# Altium schematic sheet S4V_ToF_Sensor_Module_Board_V1.0_Schematic.SchDoc
size A3; SheetNumber: 1; SheetTotal: 1
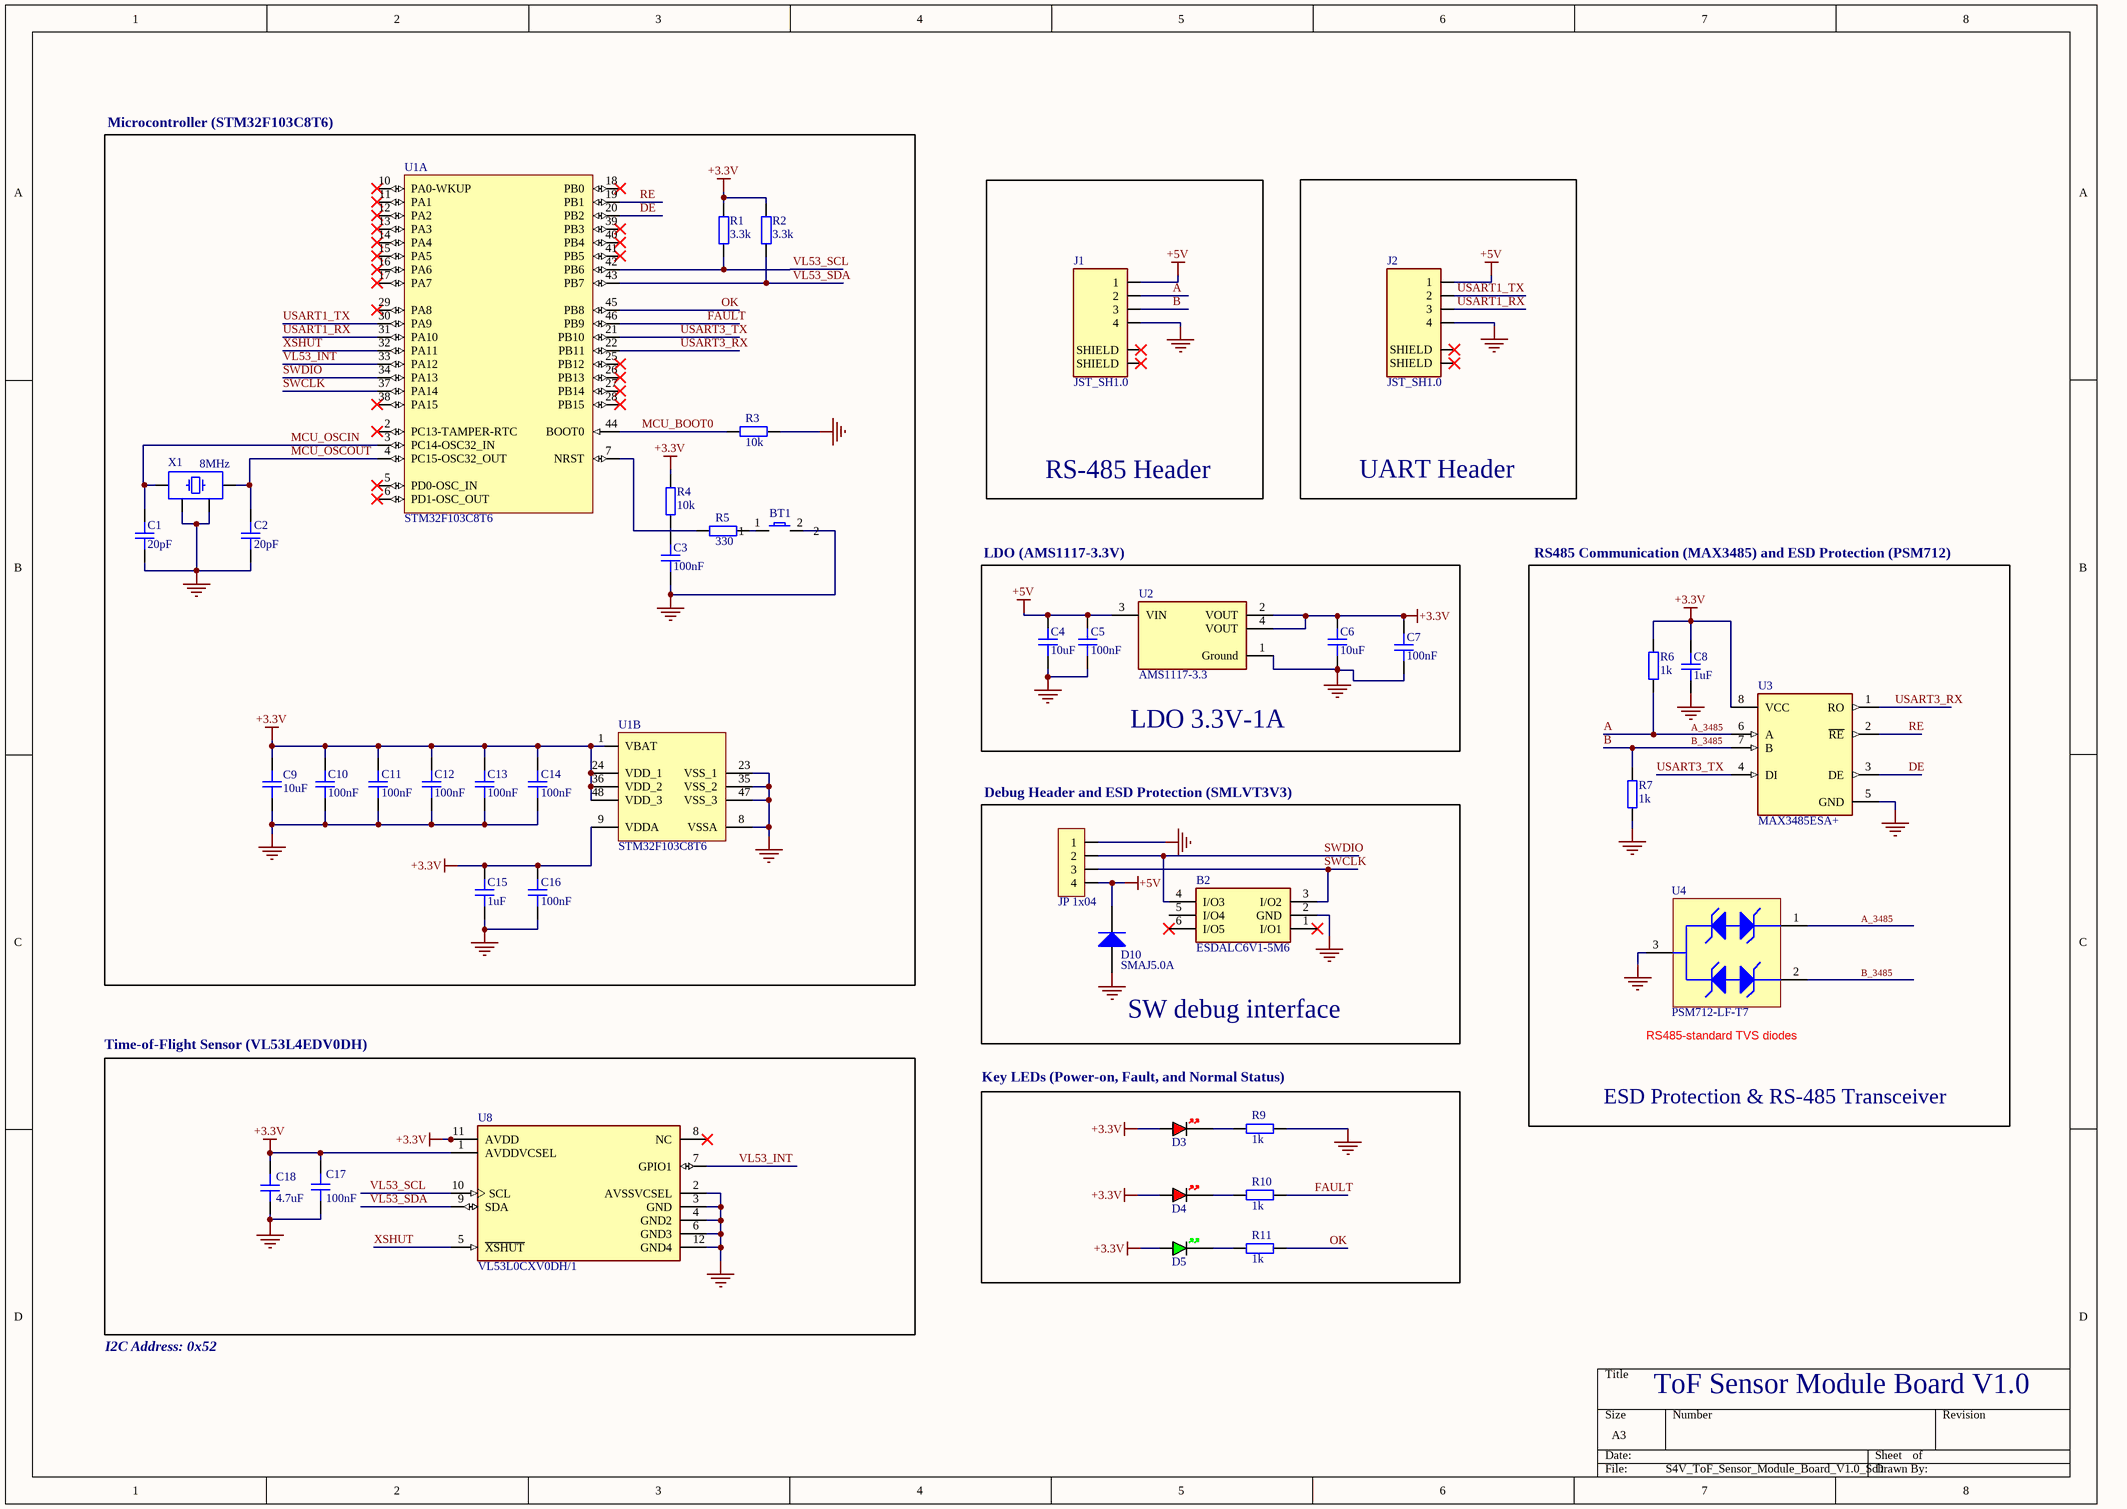
[diagram p0: S4V_ToF_Sensor_Module_Board_V1.0_Schematic.SchDoc]

## Parts
B2  ESDALC6V1-5M6  [ESDALC6V15M6]
BT1  Button_3x4mm_SMD  [Button_3x4mm_SMD]  (value not drawn)
C1  20pF  [CAP_0603]
C2  20pF  [CAP_0603]
C3  100nF  [CAP_0603]
C4  10uF  [CAP_0603]
C5  100nF  [CAP_0603]
C6  10uF  [CAP_0603]
C7  100nF  [CAP_0603]
C8  1uF  [CAP_0603]
C9  10uF  [CAP_0603]
C10  100nF  [CAP_0603]
C11  100nF  [CAP_0603]
C12  100nF  [CAP_0603]
C13  100nF  [CAP_0603]
C14  100nF  [CAP_0603]
C15  1uF  [CAP_0603]
C16  100nF  [CAP_0603]
C17  100nF  [CAP_0603]
C18  4.7uF  [CAP_0603]
D3  RED  [LED_0603_RED]  (value not drawn)
D4  RED  [LED_0603_RED]  (value not drawn)
D5  GREEN  [LED_0603_GREEN]  (value not drawn)
D10  SMAJ5.0A  [BOUR-SMA-2_V]
J1  JST_SH1.0  [JST_SM04B-SRSS-TB(LF)(SN)]
J2  JST_SH1.0  [JST_SM04B-SRSS-TB(LF)(SN)]
JP1  JP 1x04  [JP 1x4 DT]
R1  3.3k  [RES_0603]
R2  3.3k  [RES_0603]
R3  10k  [RES_0603]
R4  10k  [RES_0603]
R5  330  [RES_0603]
R6  1k  [RES_0603]
R7  1k  [RES_0603]
R9  1k  [RES_0603]
R10  1k  [RES_0603]
R11  1k  [RES_0603]
U1  STM32F103C8T6  [STM-LQFP48_L]  (parts A,B of 2)
U2  AMS1117-3.3  [FP-AMS1117-IPC_C]
U3  MAX3485ESA+  [FP-S8-5-MFG]
U4  PSM712-LF-T7  [PRKT-SOT23-3_V]
U8  VL53L0CXV0DH/1  [FP-LGA-12-MFG]
X1  8MHz  [XTAL_3225]

## Blocks framed on the sheet
Microcontroller (STM32F103C8T6): BT1 C1-C3 C9-C16 R1-R5 U1 X1
RS-485 Header: J1
UART Header: J2
LDO 3.3V-1A: C4-C7 U2
ESD Protection & RS-485 Transceiver: C8 R6 R7 U3 U4
SW debug interface: B2 D10 JP1
Time-of-Flight Sensor (VL53L4EDV0DH): C17 C18 U8
Key LEDs (Power-on, Fault, and Normal Status): D3-D5 R9-R11

## Nets
+3.3V: C6.2 C7.2 C8.2 C9.2 C10.2 C11.2 C12.2 C13.2 C14.2 C15.2 C16.2 C17.2 C18.2 D3.A D4.A D5.A R1.2 R2.2 R4.2 R6.1 U1.1(VBAT) U1.9(VDDA) U1.24(VDD_1) U1.36(VDD_2) U1.48(VDD_3) U2.2(VOUT) U2.4(VOUT) U3.8(VCC) U8.1(AVDDVCSEL) U8.11(AVDD)
+5V: C4.2 C5.2 D10.2(K) J1.1 J2.1 JP1.4 U2.3(VIN)
GND: B2.2(GND) BT1.2 C1.1 C2.1 C3.1 C4.1 C5.1 C6.1 C7.1 C8.1 C9.1 C10.1 C11.1 C12.1 C13.1 C14.1 C15.1 C16.1 C17.1 C18.1 D10.1(A) J1.4 J2.4 JP1.1 R3.2 R7.1 R9.2 U1.8(VSSA) U1.23(VSS_1) U1.35(VSS_2) U1.47(VSS_3) U2.1(Ground) U3.5(GND) U4.3 U8.2(AVSSVCSEL) U8.3(GND) U8.4(GND2) U8.6(GND3) U8.12(GND4) X1.2 X1.4
A: J1.2 R6.2 U3.6(A) U4.1  [also labelled A_3485]
B: J1.3 R7.2 U3.7(B) U4.2  [also labelled B_3485]
DE: U1.20(PB2) U3.3(DE)
FAULT: R10.2 U1.46(PB9)
MCU_BOOT0: R3.1 U1.44(BOOT0)
MCU_OSCIN: C1.2 U1.3(PC14-OSC32_IN) X1.1
MCU_OSCOUT: C2.2 U1.4(PC15-OSC32_OUT) X1.3
OK: R11.2 U1.45(PB8)
RE: U1.19(PB1) U3.2(~{RE})
SWCLK: B2.3(I/O2) JP1.3 U1.37(PA14)
SWDIO: B2.4(I/O3) JP1.2 U1.34(PA13)
USART1_RX: J2.3 U1.31(PA10)
USART1_TX: J2.2 U1.30(PA9)
USART3_RX: U1.22(PB11) U3.1(RO)
USART3_TX: U1.21(PB10) U3.4(DI)
VL53_INT: U1.33(PA12) U8.7(GPIO1)
VL53_SCL: R1.1 U1.42(PB6) U8.10(SCL)
VL53_SDA: R2.1 U1.43(PB7) U8.9(SDA)
XSHUT: U1.32(PA11) U8.5(~{XSHUT})
NetBT1_1: BT1.1 R5.2
NetC3_2: C3.2 R4.1
NetD3_K: D3.K R9.1
NetD4_K: D4.K R10.1
NetD5_K: D5.K R11.1
NetR5_1: R5.1 U1.7(NRST)

Not connected (* = marked no-connect by the designer): B2 1(I/O1)* 5(I/O4) 6(I/O5)*; J1 S1(SHIELD)* S2(SHIELD)*; J2 S1(SHIELD)* S2(SHIELD)*; U1 2(PC13-TAMPER-RTC)* 5(PD0-OSC_IN)* 6(PD1-OSC_OUT)* 10(PA0-WKUP)* 11(PA1)* 12(PA2)* 13(PA3)* 14(PA4)* 15(PA5)* 16(PA6)* 17(PA7)* 18(PB0)* 25(PB12)* 26(PB13)* 27(PB14)* 28(PB15)* 29(PA8)* 38(PA15)* 39(PB3)* 40(PB4)* 41(PB5)*; U8 8(NC)*

## Notes on the sheet
- LDO (AMS1117-3.3V)
- RS485 Communication (MAX3485) and ESD Protection (PSM712)
- (near JP1) Debug Header and ESD Protection (SMLVT3V3)
- (near U4) RS485-standard TVS diodes
- I2C Address: 0x52
- ToF Sensor Module Board V1.0

## Library data of the parts
B2 = ESDALC6V1-5M6: STMicroelectronics ESDALC6V1-5M6 Quint Uni-Directional TVS Diode, 30W peak, 6-Pin uQFN; Geometry.Height: 0.65mm; Manufacturer_Name: STMicroelectronics; Manufacturer_Part_Number: ESDALC6V1-5M6; Mouser Part Number: 511-ESDALC6V1-5M6; Mouser Price/Stock: https://www.mouser.co.uk/ProductDetail/STMicroelectronics/ESDALC6V1-5M6?qs=riAxU6JNBCsF7CaldDOuJw%3D%3D; Arrow Part Number: ESDALC6V1-5M6; Arrow Price/Stock: https://www.arrow.com/en/products/esdalc6v1-5m6/stmicroelectronics?utm_currency=USD&region=nac; Datasheet Link: https://www.st.com/resource/en/datasheet/esdalc6v1-5m6.pdf
BT1 = Button_3x4mm_SMD: Button SMD 3x4mm 2 Pins
C1-C18 = CAP_0603: Capacitor SMD 0603; Manufacturer: *; Manufacturer Part Number: *; Distributor Link: *; LCSC: *; Rating: *; Dielectric: *
D3 D4 = LED_0603_RED: LED 0603 RED SMD
D5 = LED_0603_GREEN: LED 0603 GREEN SMD
D10 = CMP-2000-07090-1: SMAJ Transient Voltage Suppressor Diode Series, 3.5 V, -55 to 150 degC, 2-Pin SMA, RoHS, Tape and Reel; Manufacturer: Bourns; EDA / CAD Models: DownloadfromAcceleratedDesigns; Unidirectional Channels: 1; Voltage - Breakdown (Min): 6.4V; Voltage - Reverse Standoff (Typ): 5V; Voltage - Clamping (Max) @ Ipp: 9.2V; Other Names: SMAJ5.0ABDKR; Type: Zener; Catalog Drawings: SMAJSeriesFootprintSMAJ,SMBJSeries; Featured Product: SMAJ/SMBJ/SMCJ/SMLJDiscreteTVSDiodes; Power - Peak Pulse: 400W; Current - Peak Pulse (10/1000µs): 43.5A; Power Line Protection: No; Online Catalog: SMAJSeries; Supplier Device Package: SMA(DO-214AC); Operating Temperature: -55°C~150°C(TJ); Package Description: 2-Pin Surface Mount Device, Body 4.315 x 2.605 mm; Datasheet URL: https://datasheet.ciiva.com/25624/0900766b8112213b-25624680.pdf; Manufacturer URL: http://www.bourns.com/; Datasheet Version: 08/2012; Series: SMAJ; Family: TVS-Diodes; Bidirectional Channels: -; Applications: GeneralPurpose; Package Reference: SMA-2; Standard Package: 1; Package / Case: DO-214AC,SMA; Category: CircuitProtection; RoHS Information: SMAJSeriesMaterialDeclaration; Mounting Technology: SurfaceMount; Capacitance @ Frequency: -; Packaging: Digi-Reel®; Mounting Type: SurfaceMount
J1 J2 = CMP-002-00071-1: Connector Header Surface Mount, Right Angle 4 position 0.039 (1.00mm); MF: JST Sales; Case/Package: None; MP: SM04B-SRSS-TB(LF)(SN); Source: SM04B-SRSS-TB(LF)(SN).SchLib; Value: *; Pins: 6; Component Type: Standard; Check_prices: https://www.snapeda.com/parts/SM04B-SRSS-TB(LF)(SN)/JST/view-part/?ref=eda; SnapEDA_Link: https://www.snapeda.com/parts/SM04B-SRSS-TB(LF)(SN)/JST/view-part/?ref=snap; Design Item ID: SM04B-SRSS-TB(LF)(SN)
JP1 = JP 1x4 2.54 Duc Thang: Cắm; Ten_Linh_Kien: Jump Đơn Đực 2.54MM 1x40P Thẳng 11MM; Don_Vi: Con; Ma_Hang: MH000903; Ghi_Chu: *; Kieu_Chan: *; Chung_Loai: Cắm
R1-R7 R9-R11 = RES_0603: Resistor SMD 0603; Manufacturer: *; Manufacturer Part Number: *; Distributor Link: *; LCSC: *
U1 = CMP-0237-00215-3: ARM Cortex-M3 32-bit MCU, 64 KB Flash, 20 KB Internal RAM, 37 I/Os, 48-pin LQFP, -40 to 85 degC, Tray; Supply Voltage(Vcc) min (V): 2; Internal RAM Size (kB): 20; FLASH Size (Prog) (kB): 64; A/D Converter: 2x12-bit (10 Channel); I/Os (High Current): 37; Operating Frequency(F) (Processor speed) (MHz): 72; Core: ARM Cortex-M3; ComponentLink3Description: Package Specification; Mounting Technology: Surface Mount; PartNumber: STM32F103C8T6; PackageReference: LQFP48; Packing: Tray; ComponentLink3URL: http://www.st.com/st-web-ui/static/active/en/resource/technical/document/datasheet/DM00058181.pdf; DatasheetVersion: Rev. 16; ComponentLink1URL: http://www.st.com/web/en/home.html; PackageVersion: Rev. 6, 06/2013; ComponentLink2URL: http://www.st.com/st-web-ui/static/active/en/resource/technical/document/datasheet/CD00161566.pdf; ComponentLink1Description: Manufacturer URL; ComponentLink2Description: Datasheet; PackageDescription: 48-Pin Low Profile Quad Flat Package, 7 x 7 mm Body, 0.5 mm Pitch
U2 = CMP-209535-000001-1: LDO Voltage Regulators 1A, 3.3V; Manufacturer: Advanced Monolithic Systems; Dropout Voltage: 1.1V; Output Type: Fixed; Nominal Supply Current: 5mA; Max Power Dissipation: 1.2W; Max Supply Voltage: 15V; Number Of Outputs: 1; Standoff Height: 0.64mm; Max Junction Temp: +125°C; Height: 1.8mm; Package: AMS1117; Device Class L2: Power Management ICs; ComponentLink2Description: Datasheet; ComponentLink2URL: http://www.advanced-monolithic.com/pdf/ds1117.pdf; Category: IC; RoHS: TRUE; Automotive: No; Device Class L1: Integrated Circuits (ICs); Output Current: 1A; Device Class L3: Voltage Regulators - Linear; Temperature: -40°C to +125°C; Output Voltage: 3.3V; Manufacturer Part Number: AMS1117-3.3; Temperature Range Low: -40°C; Octopart: https://octopart.com/ams1117-3.3-advanced+monolithic+systems-25899300; Lead Free: Yes; Ipc Land Pattern Name: SOT229P700X180-4; Temperature Range High: +125°C
U3 = CMP-05679-000038-1: IC TXRX RS485/422 10MBPS 8SOIC; Manufacturer Part Number: MAX3485EESA+; Manufacturer: Maxim Integrated; Number Of Receivers: 1; Simplex Duplex: Half Duplex; Data Rate: 15Mbits/s; Interface: RS-485,RS-422; Max Supply Voltage: 3.6V; Nominal Supply Current: 0.95-1.1mA; Min Supply Voltage: 3V; Standoff Height: 0.1mm; Mouser Description: RS-422/RS-485 Interface IC 3.3V 12Mbps Transceiver; Lead Free: Yes; Footprint Url: https://pdfserv.maximintegrated.com/land_patterns/90-0096.PDF; Device Class L1: Integrated Circuits (ICs); Device Class L3: RS-232 / RS-422 / RS-485 Interface ICs; RoHS: TRUE; Height: 1.75mm; ComponentLink2URL: https://datasheets.maximintegrated.com/en/ds/MAX3483E-MAX3491E.pdf; Temperature Range High: +85°C; Temperature: -40°C to +85°C; Number Of Transmitters: 1; Device Class L2: Interface ICs; Octopart: https://octopart.com/max3485eesa%2B-maxim+integrated-39731903; ComponentLink2Description: Datasheet; Category: IC; Digikey Description: IC TXRX RS485/422 10MBPS 8SOIC; Automotive: No; Temperature Range Low: -40°C; Package: S8-5
U4 = CMP-2000-07553-1: TVS Array - Asymmetrical Data Line Protector, 600 W, 7.5 V, -55 to 150 degC, 3-Pin SOT23, RoHS, Tape and Reel; Manufacturer: Protek Devices; Min Breakdown Voltage: 7.5V; Direction: Bidirectional; Capacitance: 75pF; Current: 20uA; Power Dissipation: 600W; Working Voltage: 7V; Voltage: 12V; Case\/Package: SOT-23; Clamping Voltage: 17V; Element Configuration: Dual; Mounting Technology: SurfaceMount; RoHSCompliant: True; Radiation Hardening: No; Depth: 1.4mm; Lead Free: LeadFree; Package Description: 3-Pin Small Outline Transistor, Body 2.92 x 1.3 mm, Pitch 0.94 mm; Max Operating Temperature: 150degC; Length: 3.04mm; Manufacturer URL: http://www.protekdevices.com/; Min Operating Temperature: -55degC; Leakage Current: 20uA; Datasheet URL: www.protekdevices.com/xyz/documents/datasheets/psm712.pdf; Packaging: TapeandReel; Datasheet Version: 10/2013; Package Reference: SOT23-3; Number of Pins: 3
U8 = CMP-2000-07484-2: SENSOR OPTICAL 200CM I2C; Manufacturer: STMicroelectronics; Operating Supply Current: 0.016-19mA; Max Supply Voltage: 3.5V; Min Supply Voltage: 1.6V; Description: Optical Sensor 200cm I²C Output; Height: 1.05mm; Package: LGA-12; Digikey Description: SENSOR OPTICAL 200CM I2C; Device Class L1: Sensors; Device Class L2: Optical Sensors; Temperature Range High: +70°C; Sensor Output: I2C; ComponentLink2URL: https://www.st.com/resource/en/datasheet/vl53l0x.pdf; RoHS: TRUE; Temperature: -20°C to +70°C; Device Class L3: unset; Lead Free: Yes; Temperature Range Low: -20°C; Category: IC; Manufacturer Part Number: VL53L0CXV0DH/1; ComponentLink2Description: Datasheet; Octopart: https://octopart.com/vl53l0cxv0dh%2F1-stmicroelectronics-71168165; Automotive: No
X1 = TSX-3225_24.0000MF15X-AC: Crystal SMD 24MHz 10PPM 7pF 3225; Manufacturer: Epson; Manufacturer Part Number: TSX-3225 24.0000MF15X-AC